# EAGLE design exp_xml (EAGLE 7.7.0)
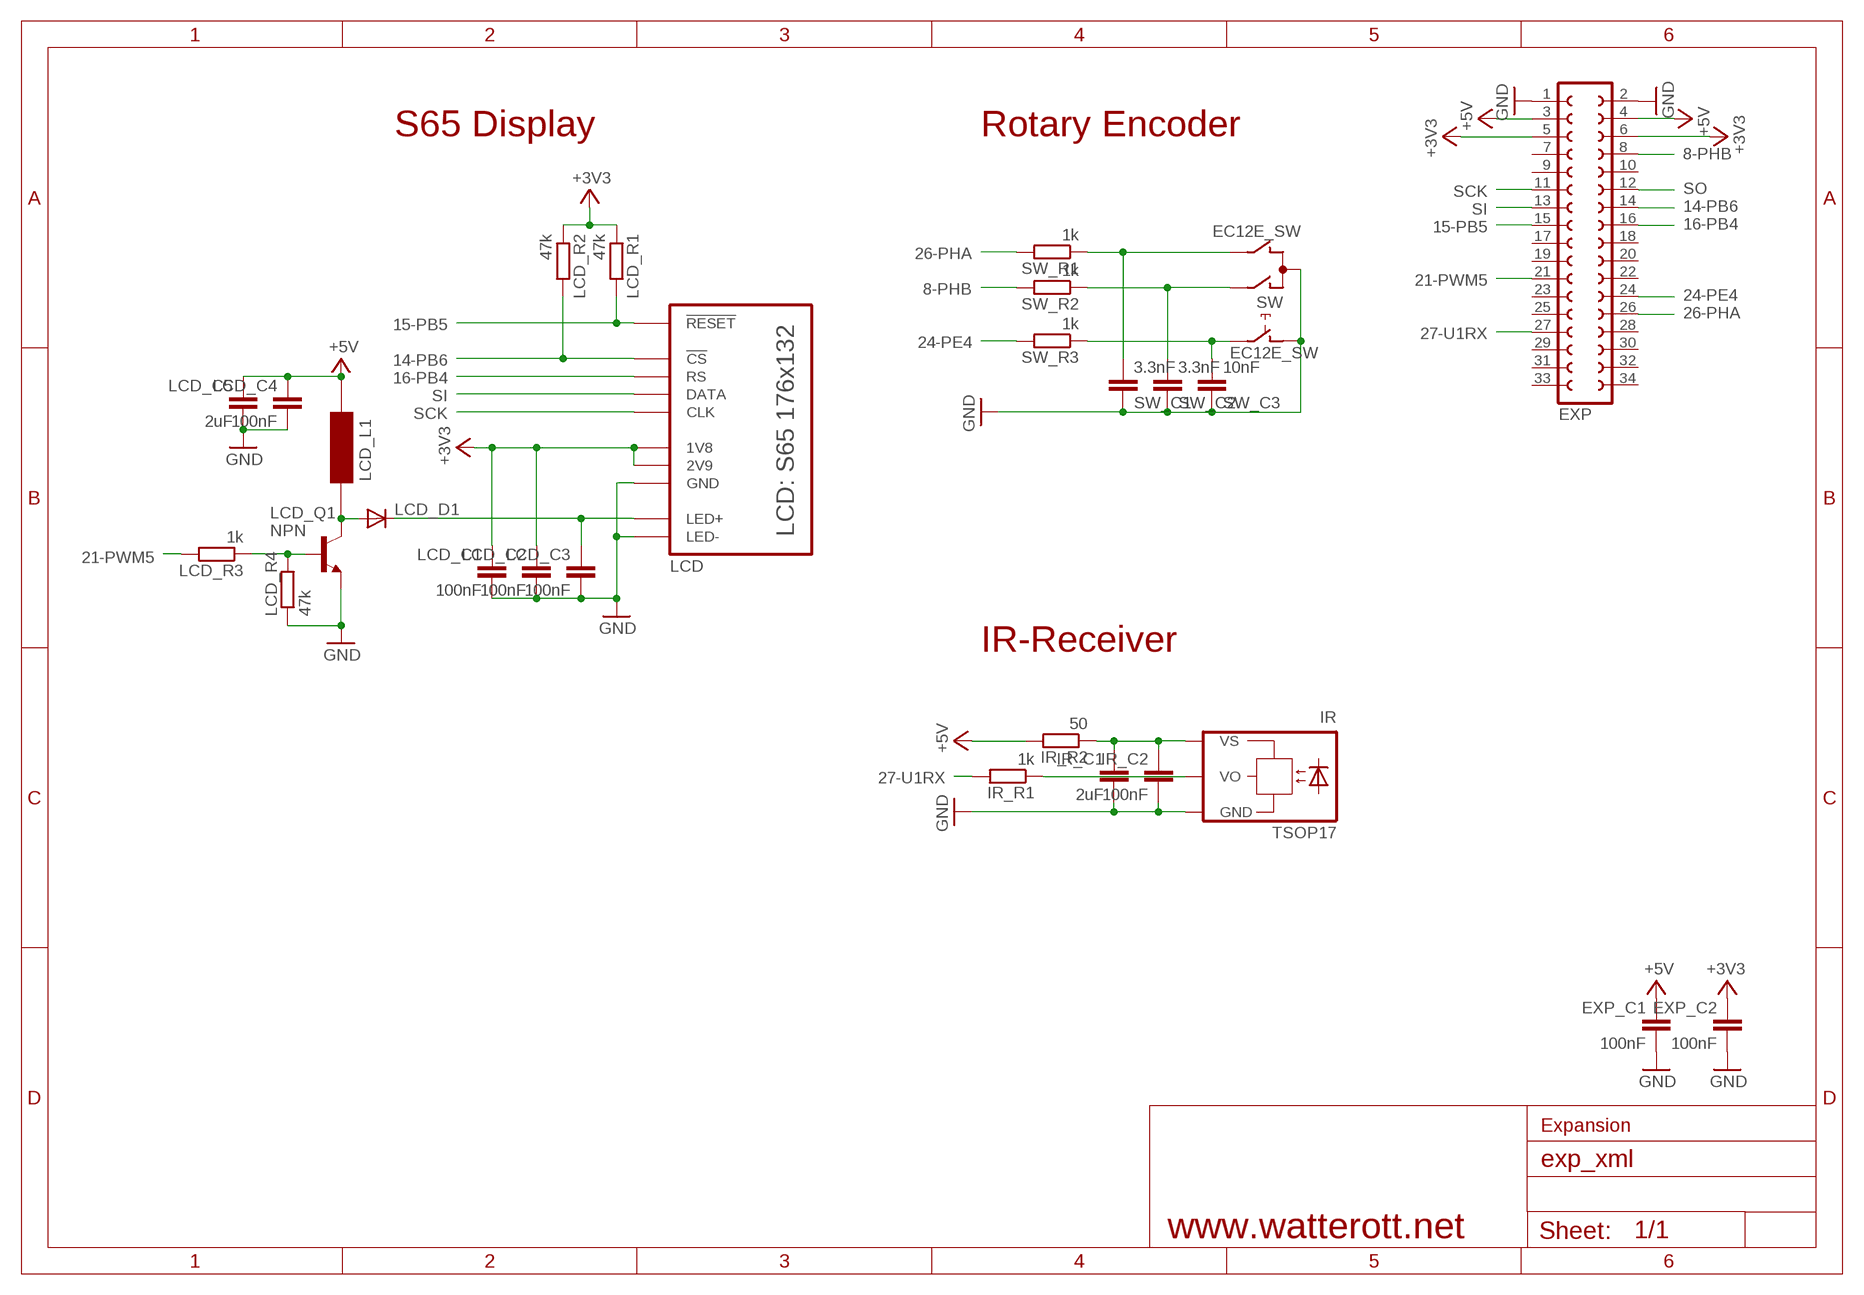
[diagram p0: schematic, sheet 1]

## Parts
EXP  FE17-2SMD  [FE17-2_SMD]
EXP_C1  100nF  C-EUC0603  [C0603]
EXP_C2  100nF  C-EUC0603  [C0603]
IR  TSOP17  [TSOP17]
IR_C1  2uF  C-EUC0603  [C0603]
IR_C2  100nF  C-EUC0603  [C0603]
IR_R1  1k  R-EU_R0603  [R0603]
IR_R2  50  R-EU_R0603  [R0603]
LCD  S65  [S65]
LCD_C1  100nF  C-EUC0603  [C0603]
LCD_C2  100nF  C-EUC0603  [C0603]
LCD_C3  100nF  C-EUC0603  [C0603]
LCD_C4  100nF  C-EUC0805  [C0805]
LCD_C5  2uF  C-EUC0805  [C0805]
LCD_D1  Schottky  DIODE-DO214AA  [DO214AA]
LCD_L1  2mH  WE-PD3-S  [WE-PD3-S]
LCD_Q1  NPN  [SOT23]
LCD_R1  47k  R-EU_R0603  [R0603]
LCD_R2  47k  R-EU_R0603  [R0603]
LCD_R3  1k  R-EU_R0603  [R0603]
LCD_R4  47k  R-EU_R0603  [R0603]
SW  EC12E_SW  [ALPS_EC12E_SW]
SW_C1  3.3nF  C-EUC0603  [C0603]
SW_C2  3.3nF  C-EUC0603  [C0603]
SW_C3  10nF  C-EUC0603  [C0603]
SW_R1  1k  R-EU_R0603  [R0603]
SW_R2  1k  R-EU_R0603  [R0603]
SW_R3  1k  R-EU_R0603  [R0603]

## Nets
8-PHB: EXP.8 SW_R2.2
14-PB6: EXP.14 LCD.CS(!CS) LCD_R2.2
15-PB5: EXP.15 LCD.RESET(!RESET) LCD_R1.2
16-PB4: EXP.16 LCD.RS
21-PWM5: EXP.21 LCD_R3.2
21-PWM523: LCD_Q1.1(B) LCD_R3.1 LCD_R4.2
24-PE4: EXP.24 SW_R3.2
26-PHA: EXP.26 SW_R1.2
27-U1RX: EXP.27 IR_R1.2
+3V3: EXP.5 EXP.6 EXP_C2.1 LCD.1V8 LCD.2V9 LCD_C1.1 LCD_C2.1 LCD_R1.1 LCD_R2.1
+5V: EXP.3 EXP.4 EXP_C1.1 IR_R2.2 LCD_C4.1 LCD_C5.1 LCD_L1.P$2
GND: EXP.1 EXP.2 EXP_C1.2 EXP_C2.2 IR.GND IR_C1.2 IR_C2.2 LCD.GND LCD.LED- LCD_C1.2 LCD_C2.2 LCD_C3.2 LCD_C4.2 LCD_C5.2 LCD_Q1.2(E) LCD_R4.1 SW.C SW.D SW_C1.1 SW_C2.1 SW_C3.1
LED+: LCD.LED+ LCD_C3.1 LCD_D1.C
N$1: SW.B SW_C1.2 SW_R1.1
N$2: LCD_D1.A LCD_L1.P$1 LCD_Q1.3(C)
N$3: SW.A SW_C2.2 SW_R2.1
N$4: SW.E SW_C3.2 SW_R3.1
SCK: EXP.11 LCD.CLK
SI: EXP.13 LCD.DATA
SO: EXP.12
VO: IR.VO IR_R1.1
VS: IR.VS IR_C1.1 IR_C2.1 IR_R2.1
Unconnected: EXP.7 EXP.9 EXP.10 EXP.17 EXP.18 EXP.19 EXP.20 EXP.22 EXP.23 EXP.25 EXP.28 EXP.29 EXP.30 EXP.31 EXP.32 EXP.33 EXP.34 SW.GND1(G) SW.GND2(G)

## Notes on the sheet
- S65 Display | Rotary Encoder
- IR-Receiver
- Expansion
- www.watterott.net

## Library data of the parts
EXP = Con-lst:FE17-2: FEMALE HEADER
EXP_C1 EXP_C2 IR_C1 IR_C2 LCD_C1-LCD_C5 SW_C1-SW_C3 = rcl:C-EU: CAPACITOR, European symbol
IR = Encoder-IR:TSOP17
IR_R1 IR_R2 LCD_R1-LCD_R4 SW_R1-SW_R3 = rcl:R-EU_: RESISTOR, European symbol
LCD = Display:S65
LCD_D1 = diode:DIODE-: DIODE
LCD_L1 = Trafo:WE-PD3-S
LCD_Q1 = Bieger:NPN: 300V NPN (Infineon SMBTA42/MMBTA42)
SW = Encoder:EC12E_SW: ALPS rotary Encoder EC12E series with switch

## Board
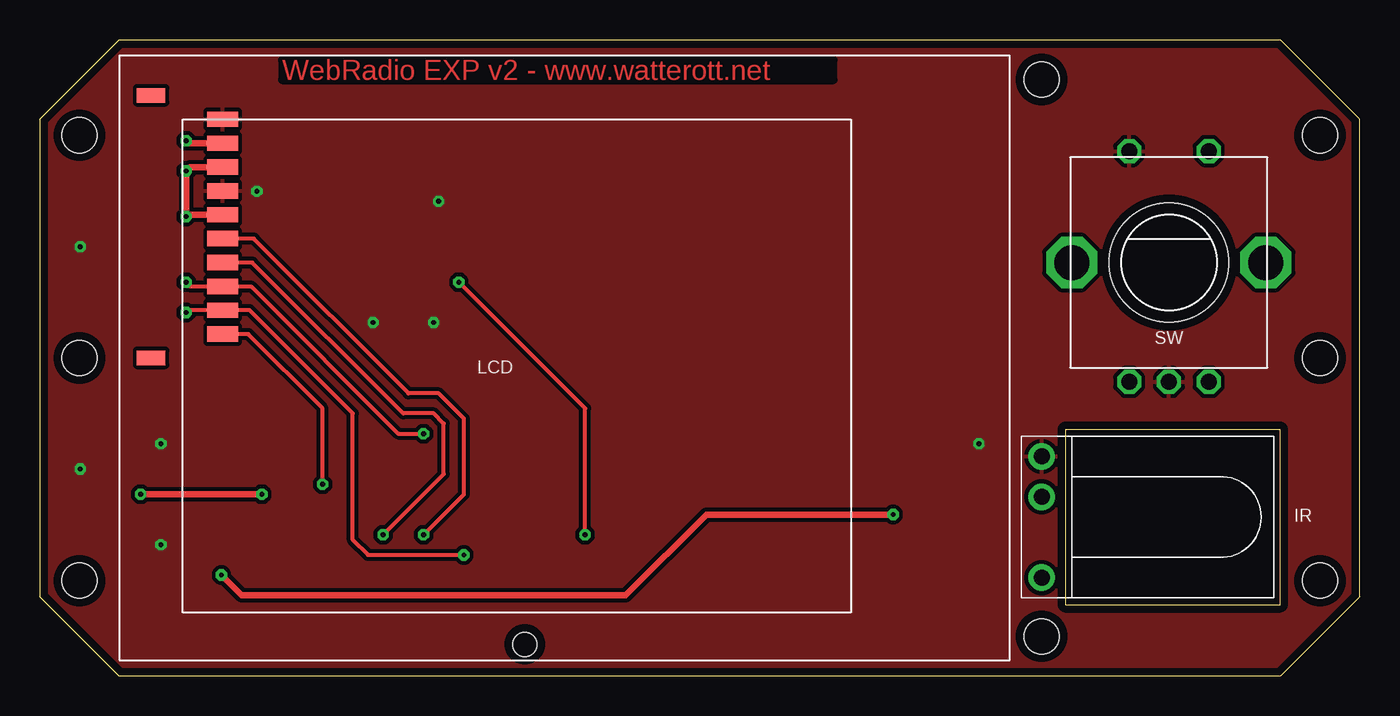
[diagram p1: board, top side]
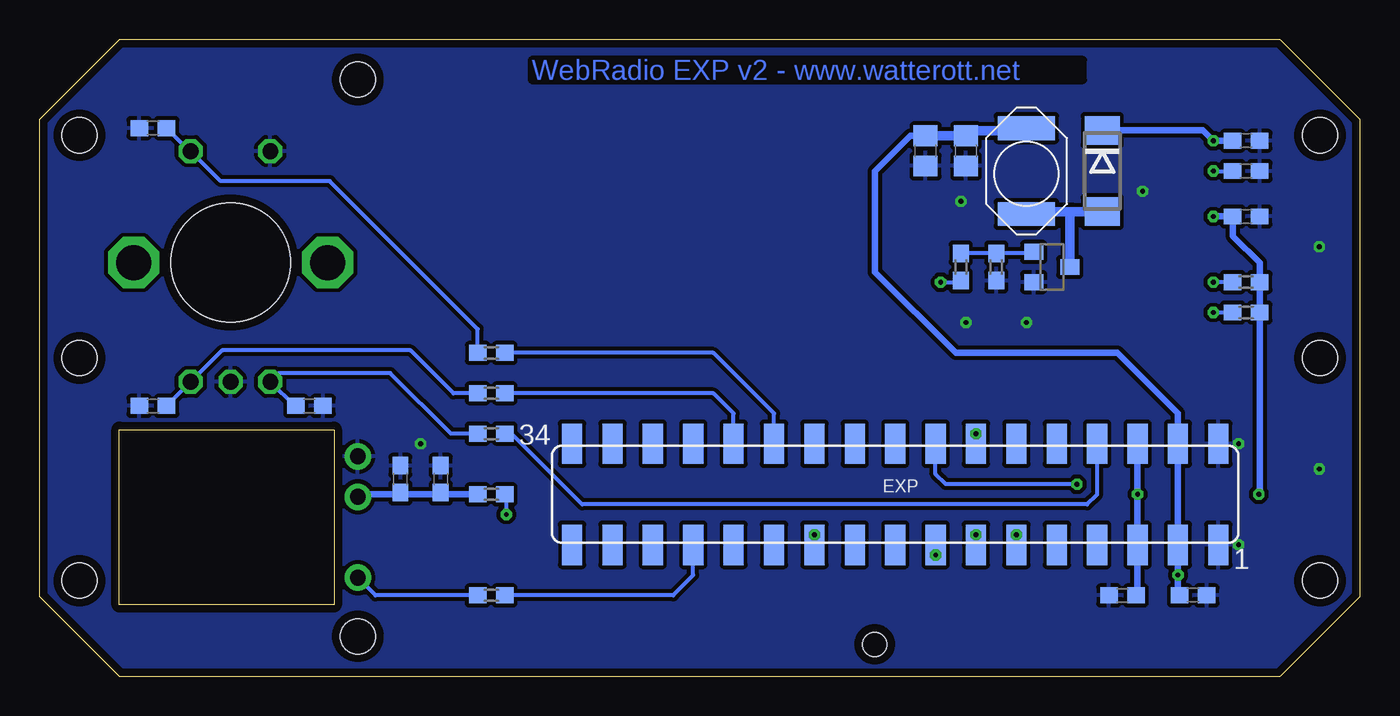
[diagram p2: board, bottom side, seen from below]

Size 83 x 40 mm. Coordinates in mm from the lower left corner, seen from the top.
Outline: 83,5 83,35 78,40 5,40 0,35 0,5 5,0 78,0 83,5
Outline: 64.5,4.5 78,4.5 78,15.5 64.5,15.5 64.5,4.5
Copper layers (1*16): Top 0.035mm / dielectric 1.5mm / Bottom 0.035mm
Design rules "default *": minimum track width 7mil, minimum drill 0.3mm, track to track 7mil, track to pad 7mil, pad to pad 7mil, via to via 7mil, smd to smd 7mil, copper to edge 20mil, drill to drill 8mil, minimum pad ring 10mil, minimum via ring 8mil, stop-mask expansion 4mil, vias tented up to drill 0.5mm, thermal gap 10mil
Holes 2.2 mm at 2.5,34 80.5,34 80.5,6 2.5,6 63,37.5 63,2.5 2.5,20 80.5,20
Holes 7.5 mm at 71,26

### Footprints (pad centres in the part's own frame; a part is rotated, then mirrored left to right if it is on the bottom)
FE17-2_SMD = smd 1.27 x 2.54: 1 -20.32,3.175; 2 -20.32,-3.175; 3 -17.78,3.175; 4 -17.78,-3.175; 5 -15.24,3.175; 6 -15.24,-3.175; 7 -12.7,3.175; 8 -12.7,-3.175; 9 -10.16,3.175; 10 -10.16,-3.175; 11 -7.62,3.175; 12 -7.62,-3.175; 13 -5.08,3.175; 14 -5.08,-3.175; 15 -2.54,3.175; 16 -2.54,-3.175; 17 0,3.175; 18 0,-3.175; 19 2.54,3.175; 20 2.54,-3.175; 21 5.08,3.175; 22 5.08,-3.175; 23 7.62,3.175; 24 7.62,-3.175; 25 10.16,3.175; 26 10.16,-3.175; 27 12.7,3.175; 28 12.7,-3.175; 29 15.24,3.175; 30 15.24,-3.175; 31 17.78,3.175; 32 17.78,-3.175; 33 20.32,3.175; 34 20.32,-3.175
C0603 = smd 1.1 x 1: 1 -0.85,0; 2 0.85,0
TSOP17 = drill 1 pad 1.676: GND 0,3.81; VO 0,-3.81; VS 0,1.27
R0603 = smd 1.1 x 1: 1 -0.85,0; 2 0.85,0
S65 = smd 1.93 x 0.965: 1V8 6.5,31; 2V9 6.5,28; CLK 6.5,25; CS 6.5,23.5; DATA 6.5,26.5; GND 6.5,29.5; LED+ 6.5,32.5; LED- 6.5,34; RESET 6.5,22; RS 6.5,20.5 | smd 1.778 x 0.914: NC1 2,19; NC2 2,35.5 | hole 1.5: 25.5,1
C0805 = smd 1.3 x 1.5: 1 -0.95,0; 2 0.95,0
DO214AA = smd 1.8 x 2.2: A 2.55,0; C -2.55,0
WE-PD3-S = smd 3.6 x 1.5: P$1 0,-2.699; P$2 0,2.699
SOT23 = smd 1 x 1.2: 1 -0.95,-1.132; 2 0.95,-1.132; 3 0,1.132
ALPS_EC12E_SW = drill 1 octagon: A -2.5,-7.5; B 2.5,-7.5; C 0,-7.5; D -2.5,7; E 2.5,7 | drill 2.2 octagon: GND1 -6.1,0; GND2 6.1,0

### Placement (x,y rotation side)
EXP  29.21,11.43 180 bottom
EXP_C1  10.48,5.08 0 bottom
EXP_C2  14.92,5.08 180 bottom
IR  63,10 0 top
IR_C1  60.33,12.38 90 bottom
IR_C2  57.78,12.38 90 bottom
IR_R1  54.61,5.08 0 bottom
IR_R2  54.61,11.43 0 bottom
LCD  5,1 0 top
LCD_C1  7.14,28.89 0 bottom
LCD_C2  7.14,31.75 0 bottom
LCD_C3  7.14,33.66 0 bottom
LCD_C4  24.77,33.02 270 bottom
LCD_C5  27.3,33.02 270 bottom
LCD_D1  16.19,31.75 270 bottom
LCD_L1  20.95,31.75 0 bottom
LCD_Q1  19.37,25.72 270 bottom
LCD_R1  7.14,22.86 180 bottom
LCD_R2  7.14,24.77 180 bottom
LCD_R3  25.08,25.72 270 bottom
LCD_R4  22.86,25.72 90 bottom
SW  71,26 0 top
SW_C1  75.88,16.99 0 bottom
SW_C2  66.04,16.99 180 bottom
SW_C3  75.88,34.45 0 bottom
SW_R1  54.61,17.78 0 bottom
SW_R2  54.61,15.24 0 bottom
SW_R3  54.61,20.32 0 bottom

### Tracks (layer width: path | path; a pad name or v marks a point on that pad's centre or on a via)
8-PHB
  Bottom 0.254: EXP.8 16.51,11.43 17.14,10.79 48.9,10.79 53.34,15.24 SW_R2.2
14-PB6  (via drill 0.3)
  Top 0.254: v9.21,24.77 9.47,24.5 LCD.CS 13.28,24.5 22.54,15.24 v24.13,15.24
  Bottom 0.254: LCD_R2.2 v9.21,24.77 | v24.13,15.24 EXP.14
15-PB5  (via drill 0.3)
  Top 0.254: v9.21,22.86 9.35,23 LCD.RESET 13.2,23 19.68,16.51 19.68,8.57 20.64,7.62 v26.67,7.62
  Bottom 0.254: v9.21,22.86 LCD_R1.2 | v26.67,7.62 EXP.15
16-PB4  (via drill 0.3)
  Top 0.254: v17.78,12.06 17.78,16.83 13.11,21.5 LCD.RS
  Bottom 0.254: EXP.16 26.67,12.7 26.04,12.06 v17.78,12.06
21-PWM5  (via drill 0.3)
  Top 0.254: v34.29,8.89 34.29,16.83 v26.35,24.77
  Bottom 0.254: EXP.21 v34.29,8.89 | v26.35,24.77 25.18,24.77 LCD_R3.2
21-PWM523
  Bottom 0.254: LCD_R3.1 LCD_R4.2 20.6,26.57 LCD_Q1.1
24-PE4
  Bottom 0.254: SW_R3.2 40.64,20.32 36.83,16.51 EXP.24
26-PHA
  Bottom 0.254: SW_R1.2 40.64,17.78 39.37,16.51 EXP.26
27-U1RX
  Bottom 0.254: EXP.27 41.91,6.35 43.18,5.08 IR_R1.2
+3V3  (via drill 0.3)
  Top 0.406: LCD.2V9 9.42,29 9.31,28.89 v9.21,28.89 v9.21,31.75 9.46,32 LCD.1V8 | v6.35,11.43 v13.97,11.43
  Bottom 0.254: 13.97,5.18 EXP_C2.1 | v9.21,31.75 LCD_C2.1
  Bottom 0.406: EXP.6 v13.97,11.43 EXP.5 13.97,5.18 | v9.21,28.89 LCD_C1.1 7.99,27.68 | LCD_R1.1 LCD_R2.1 6.29,25.98 7.94,27.62 | LCD_R1.1 | 7.94,27.62 7.99,27.68 | 7.94,27.62 7.99,27.68 | LCD_R1.1 6.29,11.49 v6.35,11.43
+5V  (via drill 0.3)
  Top 0.406: v53.66,10.16 41.91,10.16 36.83,5.08 12.7,5.08 v11.43,6.35
  Bottom 0.254: v11.43,6.35 EXP.3 | EXP_C1.1 11.43,5.18 | v53.66,10.16 53.66,11.27 53.82,11.43 IR_R2.2
  Bottom 0.406: 11.43,5.18 v11.43,6.35 EXP.3 EXP.4 11.43,16.51 15.24,20.32 25.4,20.32 30.48,25.4 30.48,31.75 28.26,33.97 LCD_C5.1 | 24.45,34.29 LCD_C4.1
  Bottom 0.61: LCD_C5.1 LCD_C4.1 | 24.45,34.29 21.11,34.29 LCD_L1.P$2
GND  (via drill 0.3)
  other vias: 2.54,13.02 2.54,26.99 7.62,14.61 7.62,8.26 59.05,14.61 20.95,22.23 24.77,22.23 13.65,30.48 25.08,29.84
  pour Top (isolate 0.254, rank 2): 0.5,35 5,39.5 78,39.5 82.5,35 82.5,5 78,0.5 5,0.5 0.5,5
  pour Bottom (isolate 0.254): 0.5,35 5,39.5 78,39.5 82.5,35 82.5,5 78,0.5 5,0.5 0.5,5
LED+  (via drill 0.3)
  Top 0.406: LCD.LED+ 9.36,33.5 v9.21,33.66
  Bottom 0.406: LCD_C3.1 v9.21,33.66 9.85,34.3 LCD_D1.C
N$1
  Bottom 0.254: SW_R1.1 56.99,17.78 59.69,20.48 71.52,20.48 SW.B 75.01,16.99 SW_C1.2
N$2
  Bottom 0.254: 20.95,29.2 LCD_L1.P$1 | 18.24,29.06 18.1,29.2
  Bottom 0.61: LCD_D1.A 18.1,29.2 20.95,29.2 | LCD_Q1.3 18.24,29.06
N$3
  Bottom 0.254: SW_R2.1 57.15,15.24 60.96,19.05 67.95,19.05 SW.A 66.99,16.99 SW_C2.2
N$4
  Bottom 0.254: SW_R3.1 55.46,21.8 64.77,31.11 71.61,31.11 SW.E 73.58,33 SW_C3.2
SCK  (via drill 0.3)
  Top 0.254: v21.59,8.89 25.4,12.7 25.4,15.88 24.77,16.51 22.86,16.51 13.37,26 LCD.CLK
  Bottom 0.254: EXP.11 v21.59,8.89
SI  (via drill 0.3)
  Top 0.254: LCD.DATA 13.46,27.5 23.18,17.78 25.08,17.78 26.67,16.19 26.67,11.43 v24.13,8.89
  Bottom 0.254: EXP.13 v24.13,8.89
VO
  Bottom 0.254: IR_R1.1 61.89,5.08 IR.VO
VS
  Bottom 0.254: 57.89,11.43 IR_C2.1 57.78,11.43
  Bottom 0.406: 57.89,11.43 60.33,11.43 | IR_R2.1 57.78,11.43 | 60.33,11.43 IR_C1.1 | 60.33,11.43 62.84,11.43 IR.VS

### Text on the board
Top: WebRadio EXP v2 - www.watterott.net
Bottom: WebRadio EXP v2 - www.watterott.net